# Altium schematic sheet 01-PCIe_40pin.SchDoc
size Tabloid; Customer: 01910; SheetNumber: 1; SheetTotal: 6
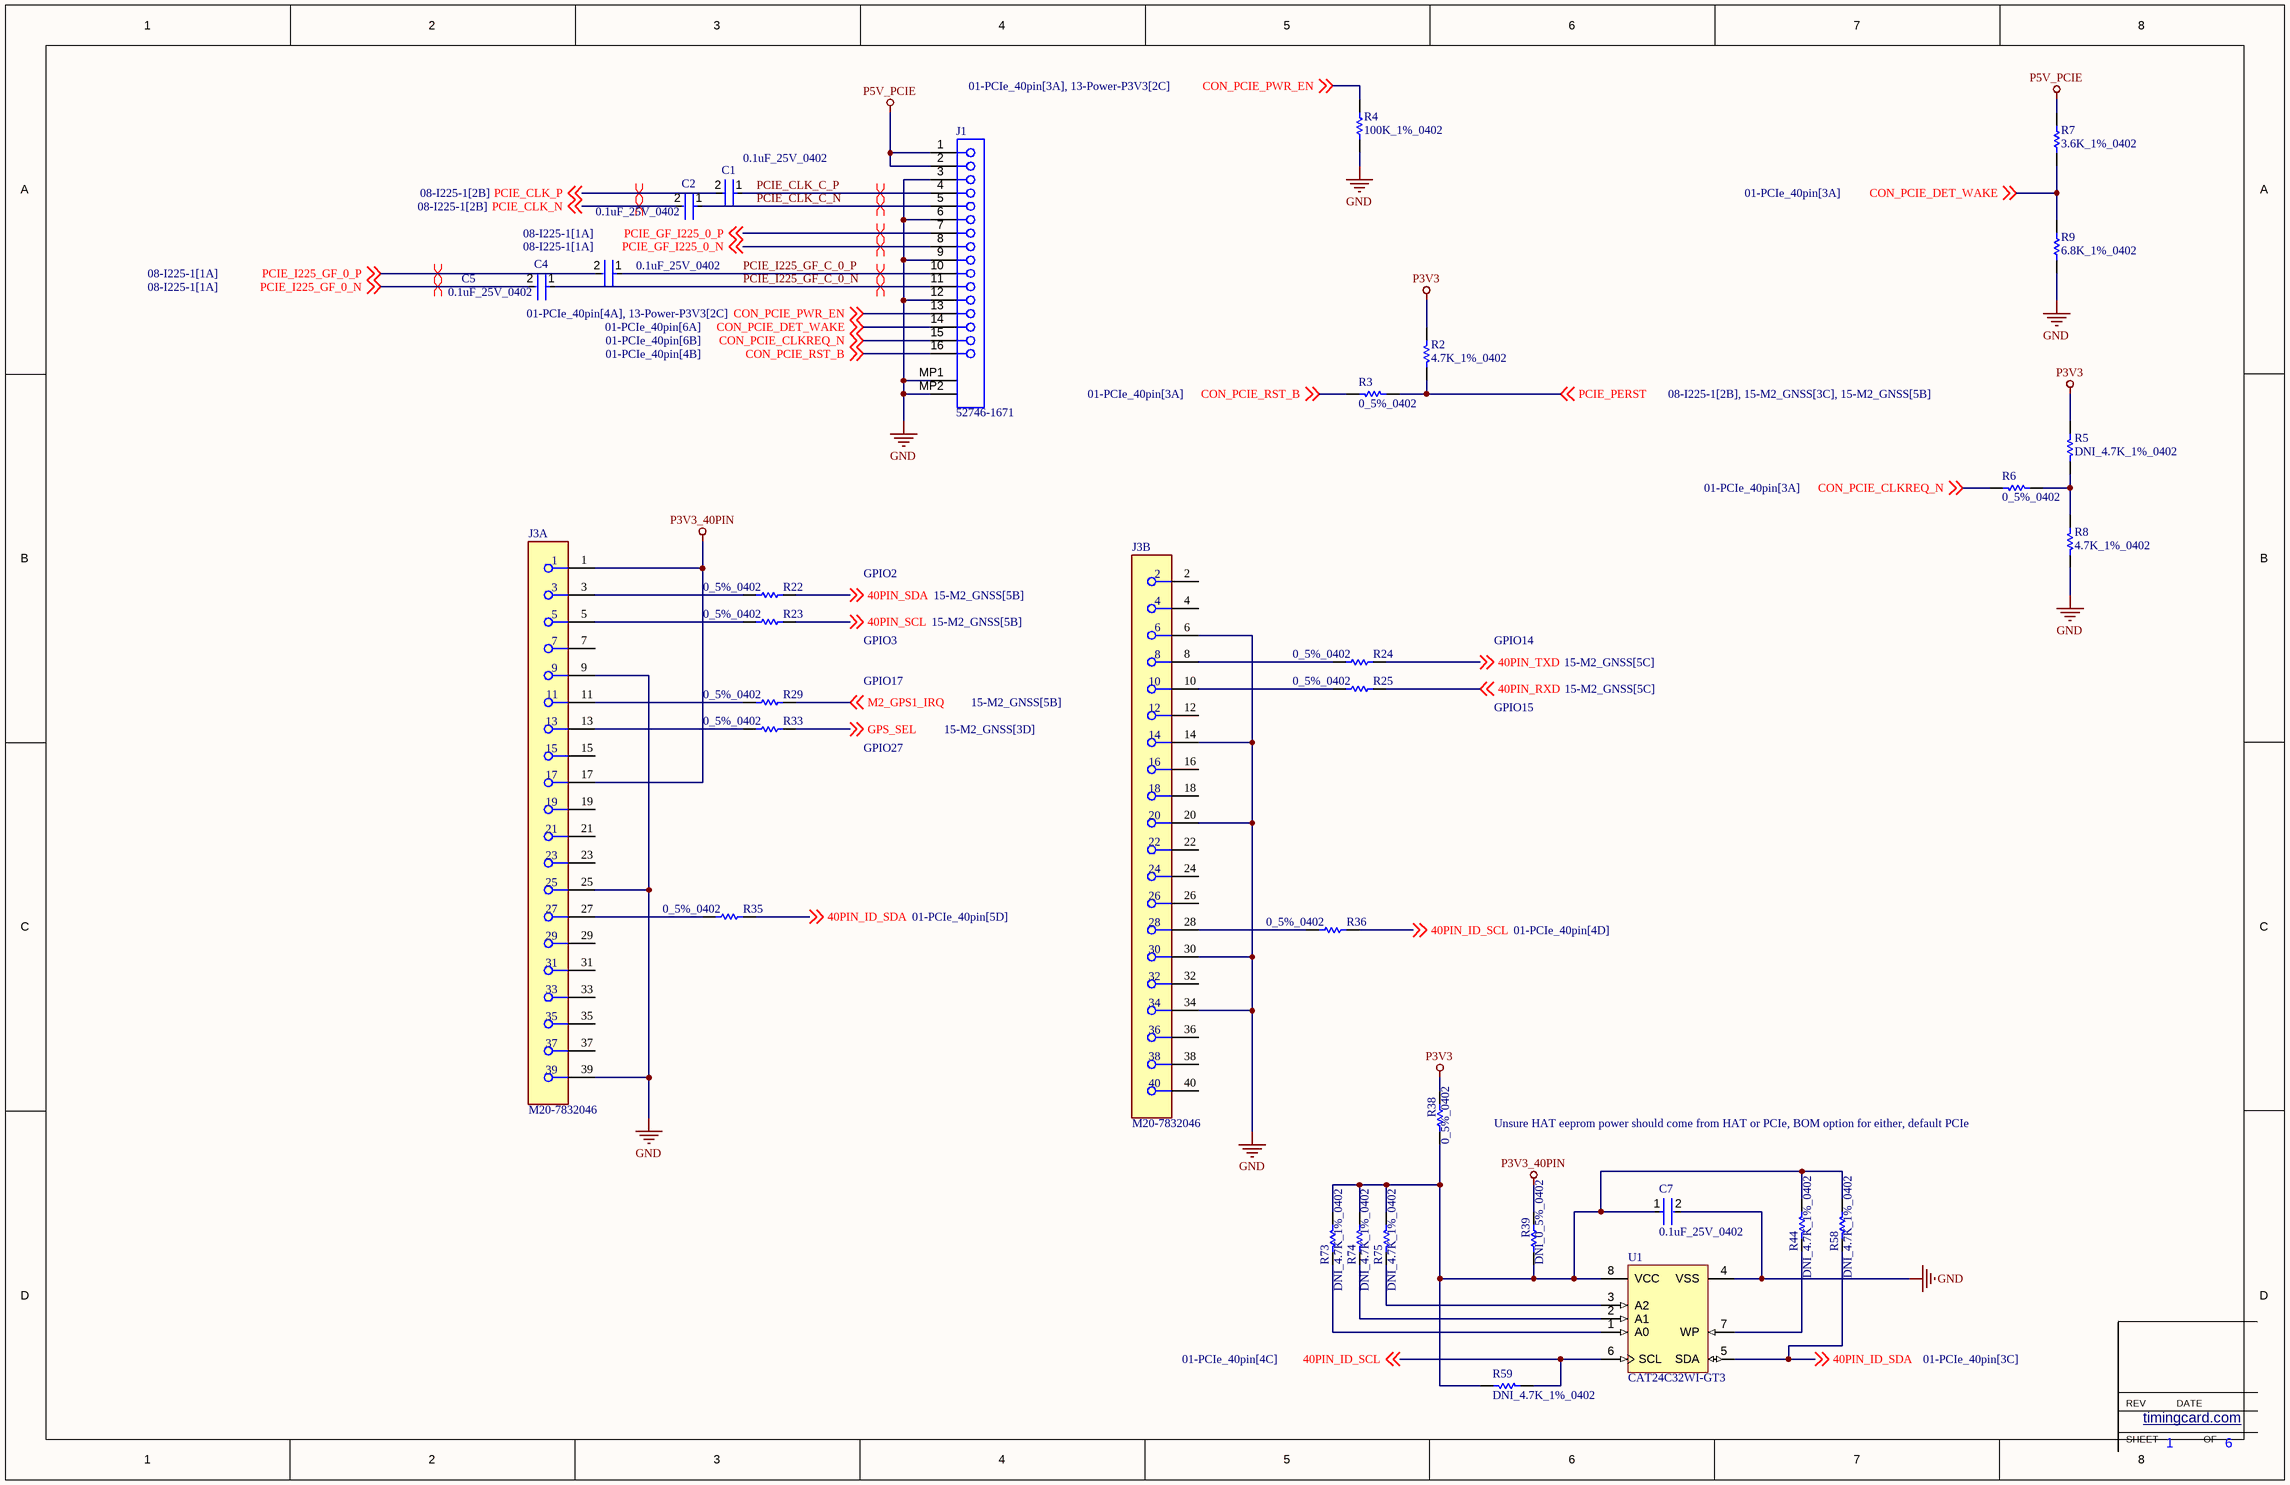
[diagram p0: 01-PCIe_40pin.SchDoc]

## Parts
C1  0.1uF_25V_0402  [FP-0402-L_1_0_1-W_0_5_0_1-IPC_C]
C2  0.1uF_25V_0402  [FP-0402-L_1_0_1-W_0_5_0_1-IPC_C]
C4  0.1uF_25V_0402  [FP-0402-L_1_0_1-W_0_5_0_1-IPC_C]
C5  0.1uF_25V_0402  [FP-0402-L_1_0_1-W_0_5_0_1-IPC_C]
C7  0.1uF_25V_0402  [FP-0402-L_1_0_1-W_0_5_0_1-IPC_C]
J1  52746-1671  [MOLX-52746-1671]
J3  M20-7832046  [FP-M20-7832046-MFG]  (parts A,B of 2)
R2  4.7K_1%_0402  [RESC1005X40X25NL10T10]
R3  0_5%_0402  [RESC1005X40X25LL10T10]
R4  100K_1%_0402  [RESC1005X40X25ML05T10]
R5  DNI_4.7K_1%_0402  [RESC1005X40X25NL10T10]  (no BOM)
R6  0_5%_0402  [RESC1005X40X25LL10T10]
R7  3.6K_1%_0402  [RESC1005X40X25ML05T10]
R8  4.7K_1%_0402  [RESC1005X40X25NL10T10]
R9  6.8K_1%_0402  [RESC1005X40X25LL10T10]
R22  0_5%_0402  [RESC1005X40X25LL10T10]
R23  0_5%_0402  [RESC1005X40X25LL10T10]
R24  0_5%_0402  [RESC1005X40X25LL10T10]
R25  0_5%_0402  [RESC1005X40X25LL10T10]
R29  0_5%_0402  [RESC1005X40X25LL10T10]
R33  0_5%_0402  [RESC1005X40X25LL10T10]
R35  0_5%_0402  [RESC1005X40X25LL10T10]
R36  0_5%_0402  [RESC1005X40X25LL10T10]
R38  0_5%_0402  [RESC1005X40X25LL10T10]
R39  DNI_0_5%_0402  [RESC1005X40X25LL10T10]  (no BOM)
R44  DNI_4.7K_1%_0402  [RESC1005X40X25NL10T10]  (no BOM)
R58  DNI_4.7K_1%_0402  [RESC1005X40X25NL10T10]  (no BOM)
R59  DNI_4.7K_1%_0402  [RESC1005X40X25NL10T10]  (no BOM)
R73  DNI_4.7K_1%_0402  [RESC1005X40X25NL10T10]  (no BOM)
R74  DNI_4.7K_1%_0402  [RESC1005X40X25NL10T10]  (no BOM)
R75  DNI_4.7K_1%_0402  [RESC1005X40X25NL10T10]  (no BOM)
U1  CAT24C32WI-GT3  [ONSC-SOIC-8-751BD-01_M]

## Nets
GND: C7.2 J1.3 J1.6 J1.9 J1.12 J1.MP1 J1.MP2 J3.6 J3.9 J3.14 J3.20 J3.25 J3.30 J3.34 J3.39 R4.1 R8.1 R9.1 U1.4(VSS)
P3V3: R2.2 R5.2 R38.2
P3V3_40PIN: J3.1 J3.17 R39.2
P5V_PCIE: J1.1 J1.2 R7.2
40PIN_ID_SCL: R36.2 R59.1 U1.6(SCL) ; off-sheet 40PIN_ID_SCL
40PIN_ID_SDA: R35.2 R58.1 U1.5(SDA) ; off-sheet 40PIN_ID_SDA
40PIN_RXD: R25.2 ; off-sheet 40PIN_RXD
40PIN_SCL: R23.2 ; off-sheet 40PIN_SCL
40PIN_SDA: R22.2 ; off-sheet 40PIN_SDA
40PIN_TXD: R24.2 ; off-sheet 40PIN_TXD
CON_PCIE_CLKREQ_N: J1.15 R6.2 ; off-sheet CON_PCIE_CLKREQ_N
CON_PCIE_DET_WAKE: J1.14 R7.1 R9.2 ; off-sheet CON_PCIE_DET_WAKE
CON_PCIE_PWR_EN: J1.13 R4.2 ; off-sheet CON_PCIE_PWR_EN
CON_PCIE_RST_B: J1.16 R3.2 ; off-sheet CON_PCIE_RST_B
GPS_SEL: R33.2 ; off-sheet GPS_SEL
M2_GPS1_IRQ: R29.2 ; off-sheet M2_GPS1_IRQ
PCIE_CLK_C_N: C2.1 J1.5
PCIE_CLK_C_P: C1.1 J1.4
PCIE_CLK_N: C2.2 ; off-sheet PCIE_CLK_N
PCIE_CLK_P: C1.2 ; off-sheet PCIE_CLK_P
PCIE_GF_I225_0_N: J1.8 ; off-sheet PCIE_GF_I225_0_N
PCIE_GF_I225_0_P: J1.7 ; off-sheet PCIE_GF_I225_0_P
PCIE_I225_GF_0_N: C4.2 ; off-sheet PCIE_I225_GF_0_N
PCIE_I225_GF_0_P: C5.2 ; off-sheet PCIE_I225_GF_0_P
PCIE_I225_GF_C_0_N: C4.1 J1.11
PCIE_I225_GF_C_0_P: C5.1 J1.10
PCIE_PERST: R2.1 R3.1 ; off-sheet PCIE_PERST
NetC7_1: C7.1 R38.1 R39.1 R44.2 R58.2 R59.2 R73.2 R74.2 R75.2 U1.8(VCC)
NetJ3_3: J3.3 R22.1
NetJ3_5: J3.5 R23.1
NetJ3_8: J3.8 R24.1
NetJ3_10: J3.10 R25.1
NetJ3_11: J3.11 R29.1
NetJ3_13: J3.13 R33.1
NetJ3_27: J3.27 R35.1
NetJ3_28: J3.28 R36.1
NetR5_1: R5.1 R6.1 R8.2
NetR44_1: R44.1 U1.7(WP)
NetR73_1: R73.1 U1.1(A0)
NetR74_1: R74.1 U1.2(A1)
NetR75_1: R75.1 U1.3(A2)

Not connected (* = marked no-connect by the designer): J3 2 4 7 12 15 16 18 19 21 22 23 24 26 29 31 32 33 35 36 37 38 40

## Layout directives
differential pair: PCIE_CLK_C_N, PCIE_CLK_C_P, PCIE_CLK_N, PCIE_CLK_P, PCIE_GF_I225_0_N, PCIE_GF_I225_0_P, PCIE_I225_GF_0_N, PCIE_I225_GF_0_P, PCIE_I225_GF_C_0_N, PCIE_I225_GF_C_0_P

## Notes on the sheet
- GPIO2
- GPIO17
- GPIO3
- GPIO14
- GPIO27
- GPIO15
- Unsure HAT eeprom power should come from HAT or PCIe, BOM option for either, default PCIe
- SHEET
- REV
- timingcard.com <http://timingcard.com>
- DATE
- OF

## Library data of the parts
C1 C2 C4 C5 C7 = CMP-2008-02519-2: General Purpose Ceramic Capacitor, 0402, 100nF, 10%, X7R, 15%, 25V; Package Quantity: 1; Capacitance: 100nF; Min Operating Temperature: -55°C; Voltage: 25V; Voltage Rating: 25V; Construction: Flat; Max Operating Temperature: 125°C; Radiation Hardening: No; Depth: 0.5mm; Thickness: 0.022inch; Voltage Rating (DC): 25V; Number of Pins: 2; Lead Free: Lead Free; Series: -; REACH SVHC: No SVHC; Length: 1mm; Dielectric: X7R; RoHS Compliant: Yes; Mount: Surface Mount; Packaging: Tape and Reel; Case/Package: 0402; Case Code (Imperial): 0402; Termination: SMD/SMT; Width: 0.02inch; Case Code (Metric): 1005; Tolerance: 10%
J1 = CMP-1241-00378-1: 0.5 mm Pitch Easy-On(TM) Type FPC Connector, 2.0 mm Mated Height, Right Angle, ZIF, SMT, Bottom Contact, 16 Circuits, -20 to 85 degC, ELV and RoHS Compliant, Tape and Reel; Manufacturer: Molex; Voltage (Max): 50V; Durability (mating cycles max): 20; Current (Max per Contact): 0.5A; Pitch - Mating Interface: 0.50mm; PCB Retention: Yes; Stackable: No; Circuits (Loaded): 16; Material - Plating Termination: Gold; Mated Height: 2.00mm; Material - Metal: Phosphor Bronze; Entry Angle: 90degrees Angle; PackageVersion: Rev. H, 05/2009; ComponentLink1URL: http://www.molex.com/molex/index.jsp; PackageReference: 52746-1671; Contact Position: Bottom; Packing: Tape and Reel; Number of Rows: 1; ComponentLink1Description: Manufacturer URL; Mounting Technology: Surface Mount; RoHS: TRUE; Polarized to PCB: Yes; PackageDescription: 16-Lead FPC Connector, Pitch 0.5 mm; ComponentLink3Description: Package Specification; Material - Plating Mating: Gold; ComponentLink3URL: http://www.molex.com/pdm_docs/sd/527461671_sd.pdf; ComponentLink2Description: Datasheet; Orientation: Right Angle; PCB Locator: No; ComponentLink2URL: http://www.molex.com/webdocs/datasheets/pdf/en-us/0527461671_FFC_FPC_CONNECTORS.pdf; PartNumber: 52746-1671
J3 = CMP-15831-000036-1: CONN RCPT 40POS 0.1 TIN PCB; Connector Type: Receptacle; Contact Resistance: 20mR; Pitch: 2.54mm; Insulation Resistance: 1MR; Mating Cycles: 50; Number of Contacts: 40; Max Current Rating: 3A; Hole Diameter: 0.8mm; Row Spacing: 0.1inch; Contact Material: Bronze; RoHS Compliant: Yes; Min Operating Temperature: -40°C; Mount: Through Hole; Gender: Receptacle; Depth: 5.04mm; Package Quantity: 11; Series: M20; REACH SVHC: No SVHC; Color: Black; Lead Pitch: 2.54mm; Max Operating Temperature: 105°C; Orientation: Straight; Radiation Hardening: No; Contact Plating: Tin; Housing Material: Polyamide; Housing Color: Black; Length: 51.2mm; Contact Gender: Female; Number of Positions: 40; Packaging: Rail/Tube; Number of Rows: 2; Material: Glass; Contact Type: Female Socket; Current Rating: 3A; Termination: Solder
R2 R5 R8 R44 R58 R59 R73-R75 = CMP-2002-05217-1: Manufacturer: Bourns; Part Number: CR0402-FX-4701GLF
R3 R6 R22-R25 R29 R33 R35 R36 R38 R39 = CMP-2002-04569-1: Manufacturer: KOA Speer; Part Number: RK73Z1ETTP
R4 = CMP-2002-07852-1: Manufacturer: Yageo; Part Number: RC0402FR-13100KL
R7 = CMP-2002-07657-1: Manufacturer: Yageo / Phycomp; Part Number: RC0402FR-073K6L
R9 = CMP-2002-06323-1: Part Number: MC00625W040216K8; Manufacturer: Multicomp
U1 = CMP-1679-00009-1: I2C CMOS Serial EEPROM, 32 Kb, 1.7 to 5.5 V, -40 to 85 degC, 8-Pin SOIC (751BD), RoHS, Tape and Reel; Case\Package: TO-226-3; hFE Min: 100; Elements: 1; Max Power Dissipation: 625 mW; Frequency: 300 MHz; Vce Max: 1 V; ComponentLink1URL: http://www.onsemi.com/; Mount: Through Hole; REACH SVHC: No SVHC; Packaging: Bulk; Height: 5.33 mm; PackageDescription: 8-Pin Small Outline Integrated Circuit, Body 4.9 x 3.9 mm, Pitch 1.27 mm; ComponentLink2Description: Datasheet; DatasheetVersion: Rev. 24, 06/2015; ComponentLink1Description: Manufacturer URL; PackageReference: SOIC-8-751BD-01; Length: 5.2 mm; ComponentLink2URL: http://www.onsemi.com/pub_link/Collateral/CAT24C32-D.PDF; Pins: 3; Min Operating Temperature: -55 degC; ComponentLink3URL: http://www.onsemi.com/pub_link/Collateral/751BD.PDF; Weight: 0.006314 oz; Max Operating Temperature: 150 degC; Package Quantity: 1000; ComponentLink3Description: Package Specification; Width: 4.19 mm; RoHSCompliant: true; Radiation Hardening: No